# Altium schematic sheet Real Time Clock.SchDoc: I2C Real Time Clock
size A4; DocumentNumber: 51; SheetNumber: 51; SheetTotal: 54
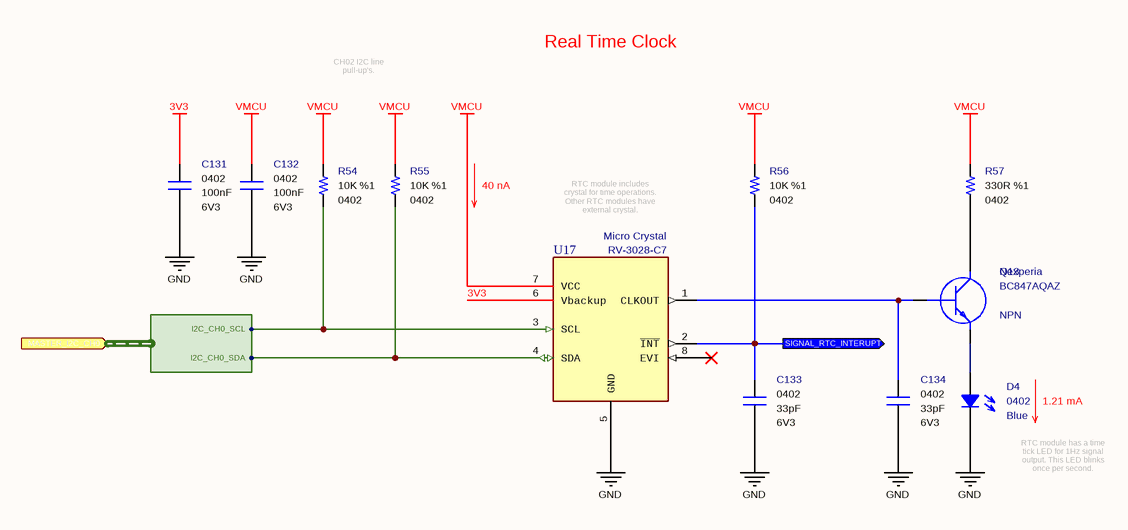
[diagram p0: Real Time Clock.SchDoc]

## Parts
C131  value 100nF  Case: 0402  Voltage: 6V3  [CAPACITOR_0402]  (hidden comment: Multilayer Ceramic Capacitor)
C132  value 100nF  Case: 0402  Voltage: 6V3  [CAPACITOR_0402]  (hidden comment: Multilayer Ceramic Capacitor)
C133  value 33pF  Case: 0402  Voltage: 6V3  [CAPACITOR_0402]  (hidden comment: Multilayer Ceramic Capacitor)
C134  value 33pF  Case: 0402  Voltage: 6V3  [CAPACITOR_0402]  (hidden comment: Multilayer Ceramic Capacitor)
D4  Case: 0402  Color: Blue  [LED_0402]  (hidden comment: SMD LED (Blue))
Q13  Polarity: NPN  Manufacturer Name: Nexperia  Manufacturer Part Number: BC847AQAZ  [SOT1215]  (hidden comment: Bipolar NPN Transistors)
R54  value 10K  Tolerance: %1  Case: 0402  [RESISTOR_0402]  (hidden comment: Thick Film Resistor)
R55  value 10K  Tolerance: %1  Case: 0402  [RESISTOR_0402]  (hidden comment: Thick Film Resistor)
R56  value 10K  Tolerance: %1  Case: 0402  [RESISTOR_0402]  (hidden comment: Thick Film Resistor)
R57  value 330R  Tolerance: %1  Case: 0402  [RESISTOR_0402]  (hidden comment: Thick Film Resistor)
U17  Manufacturer Name: Micro Crystal  [RV-3028-C7]  (hidden comment: Real Time Clock)

## Ports
MASTER_I2C_CH0 (in, harness MASTER_I2C_CH0), SIGNAL_RTC_INTERUPT (out)

## Harnesses
MASTER_I2C_CH0: I2C_CH0_SDA, I2C_CH0_SCL

## Nets
3V3: C131.2 U17.6(Vbackup)
GND: C131.1 C132.1 C133.2 C134.2 D4.1 U17.5(GND)
VMCU: C132.2 R54.2 R55.2 R56.2 R57.2 U17.7(VCC)
SIGNAL_RTC_INTERUPT: C133.1 R56.1 U17.2(~{INT}) ; port SIGNAL_RTC_INTERUPT
NetC134_1: C134.1 Q13.1(B) U17.1(CLKOUT)
NetD4_2: D4.2 Q13.2(E)
NetQ13_3: Q13.3(C) R57.1
NetR54_1: R54.1 U17.3(SCL) ; port MASTER_I2C_CH0.I2C_CH0_SCL
NetR55_1: R55.1 U17.4(SDA) ; port MASTER_I2C_CH0.I2C_CH0_SDA

Not connected (* = marked no-connect by the designer): U17 8(EVI)*

## Notes on the sheet
- Real Time Clock
- CH02 I2C line pull-up's.
- 40 nA
- RTC module includes crystal for time operations. Other RTC modules have external crystal.
- 1.21 mA
- RTC module has a time tick LED for 1Hz signal output. This LED blinks once per second.
- Engineer
- All Rights are reserved to Customer and Engineer. [2021]
- Size:
- Date:
- A4
- Project :
- Time:
- Sheet
- of
- Customer
- Product ID
- Module ID
- Version
- File:
- Revision

## Library data of the parts
C131 C132 = Capacitor - 100nF [0402-6V3]: Capacitor - 100nF [0402-6V3] (Ceramic); Manufacturer Name: AVX; Manufacturer Part Number: 04026D104KAT4A; Dielectric: X5R; Tolerance: %10; Height: 0.25mm; ComponentLink1Description: Mouser; ComponentLink1URL: https://www.mouser.com.tr/ProductDetail/AVX/04026D104KAT4A?qs=sGAEpiMZZMs0AnBnWHyRQPg4iYkCw7IMED%2F4kpqgf7w%3D; ComponentLink2Description: DataSheet; ComponentLink2URL: https://www.mouser.com.tr/datasheet/2/40/cx5r-776519.pdf; ROHS: Yes; Maximum Operating Temperature: +85; Minimum Operating Temperature: -55; Supplier 1: Avnet; Supplier Part Number 1: 04026D104KAT4A; Mouser Part Number: 581-04026D104KAT4A
C133 C134 = Capacitor - 33pF [0402-6V3]: Capacitor - 33pF [0402] (Ceramic); Manufacturer Name: Kemet; Manufacturer Part Number: C0402C330J9RACAUTO; Dielectric: X7R; Tolerance: 10%; Height: 0.5mm; Maximum Operating Temperature: +125; Minimum Operating Temperature: -55; ROHS: Yes; ComponentLink1Description: DataSheet; ComponentLink1URL: https://api.kemet.com/component-edge/download/datasheet/C0402C330J9RACAUTO.pdf; ComponentLink2Description: Mouser; ComponentLink2URL: https://www.mouser.com/Search/Refine.aspx?Keyword=80-C0402C330J9RAUTO; Supplier 1: Mouser; Supplier Part Number 1: 80-C0402C330J9RAUTO; Mouser Part Number: 80-C0402C330J9RAUTO
D4 = Diode - LED (0402-Blue): Standard LEDs - SMD PICOLEDTM;BLUE LED; 25M @ 5MA; Manufacturer Name: ROHM Semiconductor; Manufacturer Part Number: SMLP13BC8TT86; ROHS: Yes; ComponentLink1Description: DataSheet; ComponentLink1URL: https://d1d2qsbl8m0m72.cloudfront.net/en/products/databook/datasheet/opto/led/chip_mono/sml-p1-e.pdf; ComponentLink2Description: Mouser; ComponentLink2URL: https://www.mouser.com.tr/ProductDetail/ROHM-Semiconductor/SMLP13BC8TT86?qs=%2Fha2pyFaduidYDgXFKL%252BNZwCVZNUI4FlyPWWbVDx1b6ABmzS%252BS2f0w%3D%3D; Supplier 1: Mouser; Supplier 2: Digi-Key; Supplier Part Number 1: 755-SMLP13BC8TT86; Supplier Part Number 2: 846-1112-1-ND; Mouser Part Number: 755-SMLP13BC8TT86
Q13 = Transistor - BC847: Bipolar Transistors - BJT BC847AQA/DFN1010D-3/REEL 7" Q2; ComponentLink1Description: DataSheet; ComponentLink1URL: https://www.mouser.com.tr/datasheet/2/916/BC847XQA_SER-1598405.pdf; ComponentLink2Description: Mouser; ComponentLink2URL: https://www.mouser.com.tr/ProductDetail/Nexperia/BC847AQAZ?qs=%2Fha2pyFaduhKMCPKNtQimeJpXTw9z4AqURd2YARs8DVICZNv3AT9Dw%3D%3D; Case: DFN-1010D-3; Supplier 1: Mouser; Supplier 2: Digi-Key; Supplier Part Number 1: 771-BC847AQAZ; Supplier Part Number 2: 1727-2545-1-ND; Mouser Part Number: 771-BC847AQAZ
R54-R56 = Resistor - 10K: Thick Film Resistors - SMD 1/16 W 10 Kohms 1%; Manufacturer Name: Vishay; Manufacturer Part Number: CRCW040210K0FKED; Height: 0.4mm; ComponentLink1Description: DataSheet; ComponentLink1URL: https://www.mouser.com.tr/datasheet/2/427/dcrcwe3-1762152.pdf; ComponentLink2Description: Mouser; ComponentLink2URL: https://www.mouser.com.tr/ProductDetail/Vishay-Dale/CRCW040210K0FKED?qs=sGAEpiMZZMu61qfTUdNhG2DpbjADlD3GcalbOv9utCY%3D; Supplier 1: Mouser; Supplier 2: Digi-Key; Supplier Part Number 1: 71-CRCW040210K0FKEDH; Supplier Part Number 2: 541-10.0KYCT-ND; Mouser Part Number: 71-CRCW0402-10K-E3
R57 = Resistor - 330R: Thick Film Resistors - SMD 1/16 W 330 Ohm 1%; Manufacturer Name: Vishay; Manufacturer Part Number: CRCW0402330RFKED; Height: 0.4mm; ComponentLink1Description: DataSheet; ComponentLink1URL: https://www.mouser.com.tr/datasheet/2/427/dcrcwe3-1762152.pdf; ComponentLink2Description: Mouser; ComponentLink2URL: https://www.mouser.com.tr/ProductDetail/Vishay-Dale/CRCW0402330RFKED?qs=sGAEpiMZZMu61qfTUdNhG2DpbjADlD3GGS6SwBlLi5Q%3D; Supplier 1: Mouser; Supplier 2: Digi-Key; Supplier Part Number 2: 541-330LCT-ND; Supplier Part Number 1: 71-CRCW0402-330-E3; Mouser Part Number: 71-CRCW0402-330-E3
U17 = IC - RV-3028-C7: Real Time Clock 32.768kHz I2C Time Acc. 1ppm; ComponentLink1Description: DataSheet; ComponentLink1URL: https://eu.mouser.com/datasheet/2/530/RV-3028-C7-1524919.pdf; ComponentLink2Description: Mouser; ComponentLink2URL: https://eu.mouser.com/ProductDetail/Micro-Crystal/RV-3028-C7-32768kHz-1ppm-TA-QC?qs=sGAEpiMZZMtpeOq%2F1QMb1b6mUOvJOzpDTOpQRtK3%252B9k%3D; Minimum Operating Temperature: -40; Maximum Operating Temperature: +85; Supplier 1: Digi-Key; Supplier Part Number 1: 2195-RV-3028-C732.768KHZ1PPM-TA-QCCT-ND; Case: SMD; Mouser Part Number: 428-203591-MG01; Manufacturer Part Number: RV-3028-C7